# Altium schematic sheet TOP.SchDoc: XC7A3G
size A4; Date: 9 AUG 2026; Engineer: Parsa Malekpour; Revision: 1.0.0; SheetNumber: 1; SheetTotal: 18
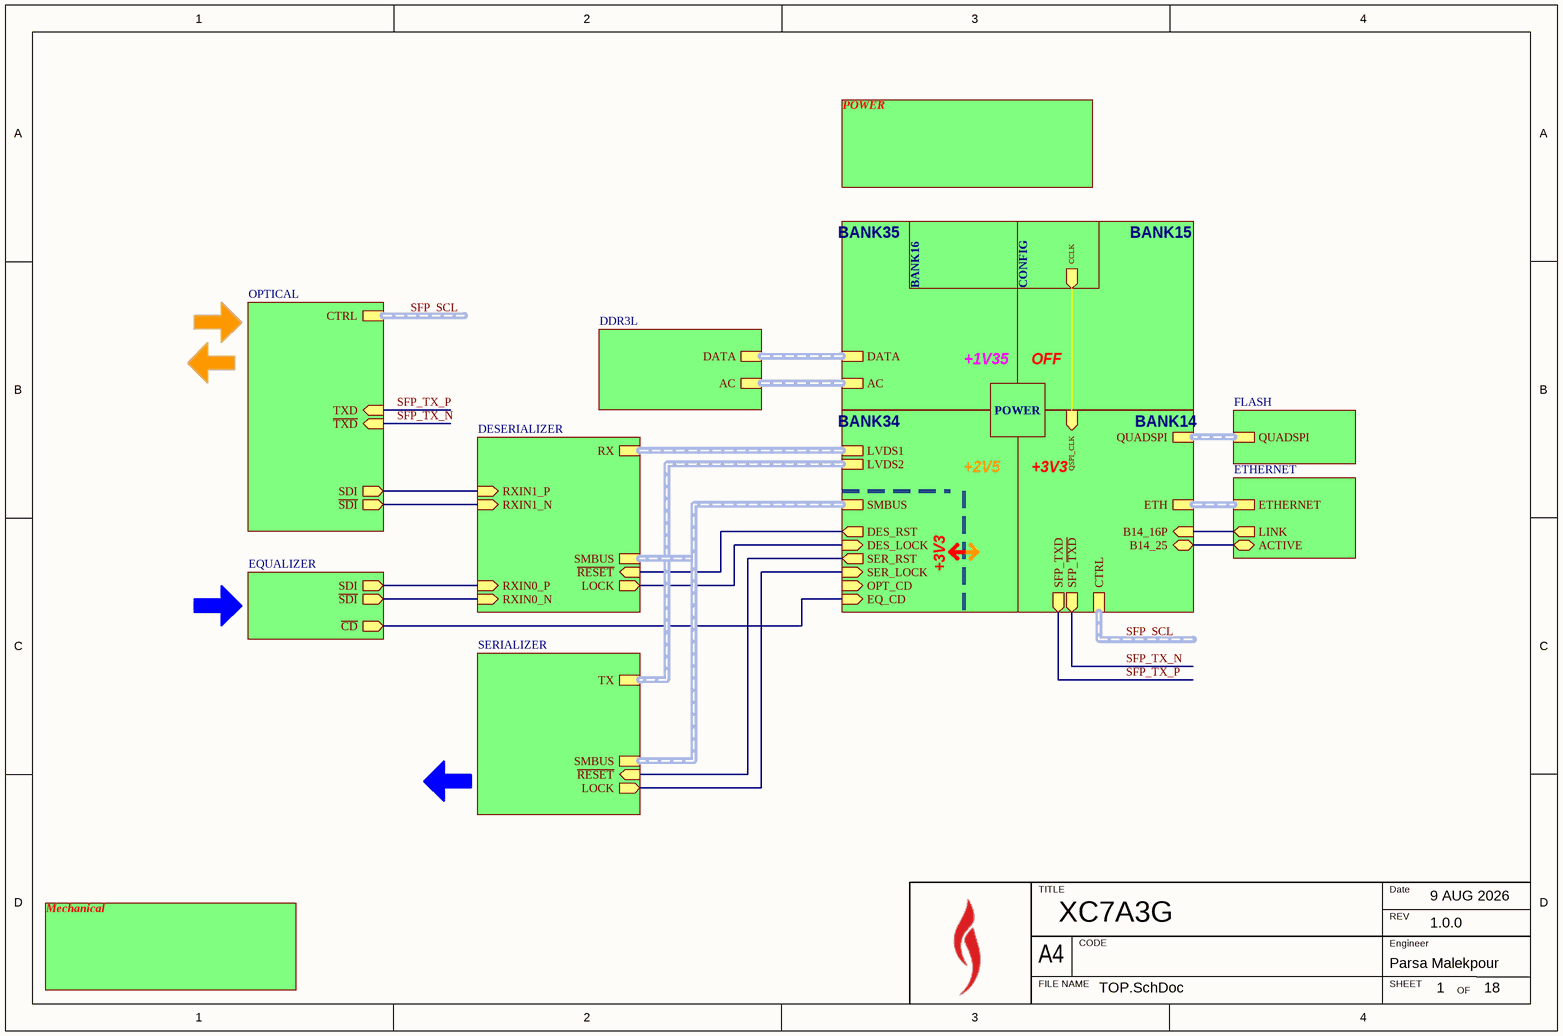
[diagram p0: TOP.SchDoc]

## Sub-sheets
BANK14 = BANK14.SchDoc: ETH (harness ETHERNET), B14_25 (bidir), B14_16P (in), QUADSPI (harness QUADSPI), QSPI_CLK (in), CTRL (harness SFP_CTRL), SFP_TXD (out), SFP_~{TXD} (out)
BANK15 = BANK15.SchDoc: no entries
BANK16 = BANK16.SchDoc: no entries
BANK34 = BANK34.SchDoc: LVDS1 (harness LVDS), LVDS2 (harness LVDS), SMBUS (harness SMBUS), SER_LOCK (in), OPT_CD (in), DES_RST (out), DES_LOCK (in), SER_RST (out), EQ_CD (in)
BANK35 = BANK35.SchDoc: DATA (harness DDR3_DATA), AC (harness DDR3_AC)
CONFIG = FPGA CONFIG.SchDoc: CCLK (out)
DDR3L = DDR.SchDoc: DATA (harness DDR3_DATA), AC (harness DDR3_AC)
DESERIALIZER = DESERILIZER.SchDoc: RXIN0_N (in), RXIN0_P (in), RXIN1_N (in), RXIN1_P (in), RX (harness LVDS), ~{RESET} (in), LOCK (out), SMBUS (harness SMBUS)
EQUALIZER = EQULIZER.SchDoc: SDI (out), ~{SDI} (out), ~{CD} (out)
ETHERNET = ETHERNET.SchDoc: ETHERNET (harness ETHERNET), LINK (out), ACTIVE (bidir)
FLASH = FLASH.SchDoc: QUADSPI (harness QUADSPI)
Mechanical = Mechanical.SchDoc: no entries
OPTICAL = OPTICS.SchDoc: SDI (out), ~{SDI} (out), CTRL (harness SFP_CTRL), ~{TXD} (in), TXD (in)
POWER = FPGA PWR.SchDoc: no entries
POWER = POWER.SchDoc: no entries
SERIALIZER = SERIALIZER.SchDoc: ~{RESET} (in), TX (harness LVDS), LOCK (out), SMBUS (harness SMBUS)

## Nets
SFP_TX_N: sheet BANK14/SFP_~{TXD}, sheet OPTICAL/~{TXD}
SFP_TX_P: sheet BANK14/SFP_TXD, sheet OPTICAL/TXD
(unnamed): sheet BANK14/B14_25, sheet ETHERNET/ACTIVE
(unnamed): sheet BANK14/B14_16P, sheet ETHERNET/LINK
(unnamed): sheet BANK14/QSPI_CLK, sheet CONFIG/CCLK
(unnamed): sheet BANK34/SER_LOCK, sheet SERIALIZER/LOCK
(unnamed): sheet BANK34/DES_RST, sheet DESERIALIZER/~{RESET}
(unnamed): sheet BANK34/DES_LOCK, sheet DESERIALIZER/LOCK
(unnamed): sheet BANK34/SER_RST, sheet SERIALIZER/~{RESET}
(unnamed): sheet BANK34/EQ_CD, sheet EQUALIZER/~{CD}
(unnamed): sheet EQUALIZER/SDI, sheet DESERIALIZER/RXIN0_P
(unnamed): sheet EQUALIZER/~{SDI}, sheet DESERIALIZER/RXIN0_N
(unnamed): sheet DESERIALIZER/RXIN1_N, sheet OPTICAL/~{SDI}
(unnamed): sheet DESERIALIZER/RXIN1_P, sheet OPTICAL/SDI

## Buses and harness runs
harness SFP_SCL = sheet BANK14/CTRL
harness SFP_SCL = sheet OPTICAL/CTRL
harness sheet BANK14/ETH = sheet ETHERNET/ETHERNET
harness sheet BANK14/QUADSPI = sheet FLASH/QUADSPI
harness sheet BANK34/LVDS1 = sheet DESERIALIZER/RX
harness sheet BANK34/LVDS2 = sheet SERIALIZER/TX
harness sheet BANK34/SMBUS = sheet DESERIALIZER/SMBUS = sheet SERIALIZER/SMBUS
harness sheet BANK35/AC = sheet DDR3L/AC
harness sheet BANK35/DATA = sheet DDR3L/DATA

## Notes on the sheet
- +1V35
- OFF
- +2V5
- +3V3
- TITLE
- REV
- Date
- A4
- FILE NAME
- CODE
- SHEET
- Engineer
- OF